# EAGLE design Order339582-10x10-SandyNoble-Polarshieldv1.5 (EAGLE 6.4)
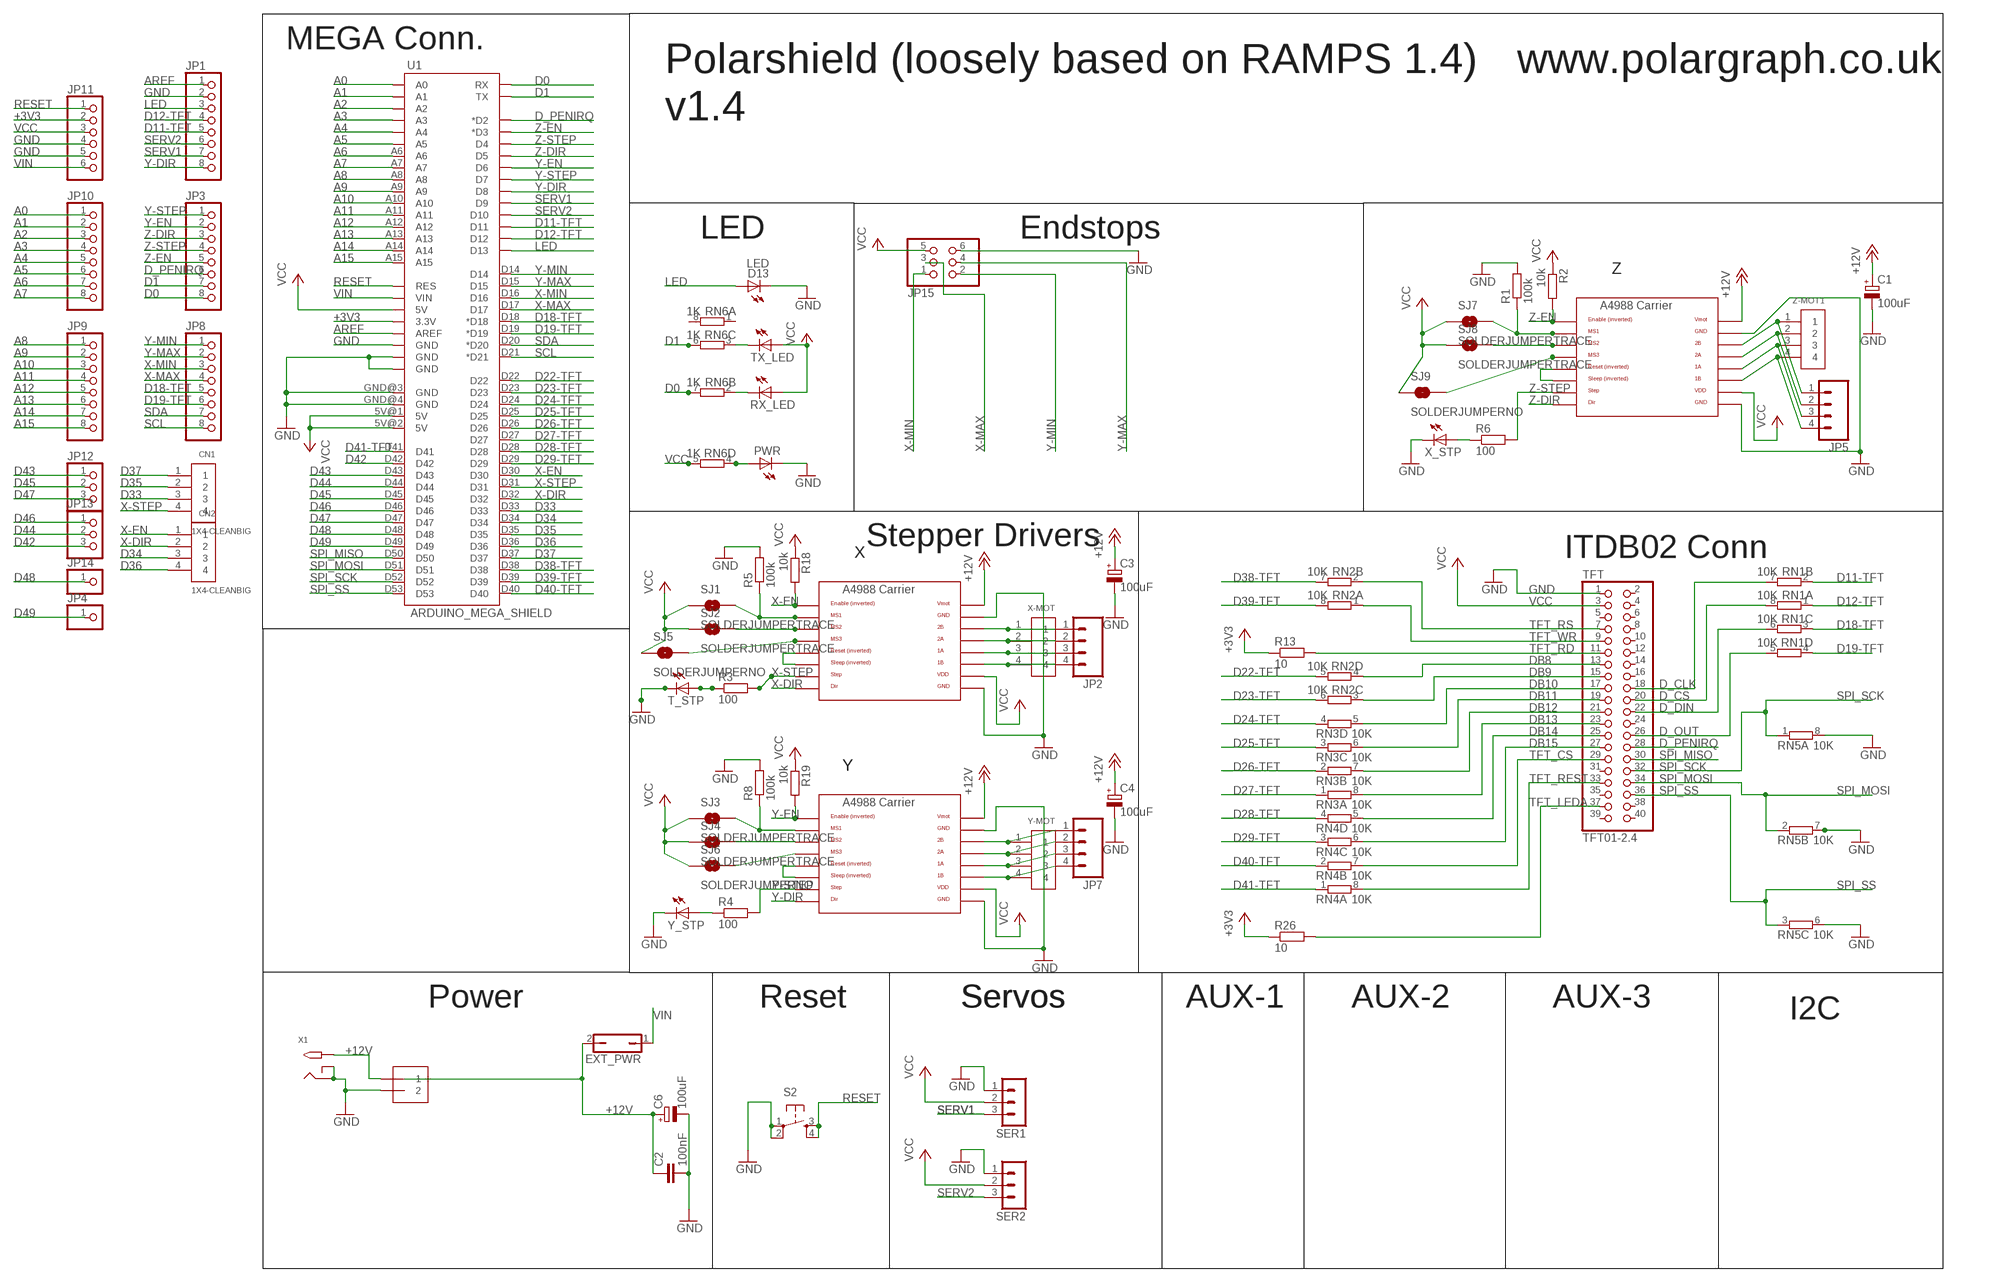
[diagram p0: schematic, sheet 1]

## Parts
C1  100uF  CPOL-EU153CLV-0605  [153CLV-0605]
C2  100nF  C-EUC0805  [C0805]
C3  100uF  CPOL-EU153CLV-0605  [153CLV-0605]
C4  100uF  CPOL-EU153CLV-0605  [153CLV-0605]
C6  100uF  CPOL-EU153CLV-0605  [153CLV-0605]
CN1  1X4-CLEANBIG  [1X04-CLEANBIG]
CN2  1X4-CLEANBIG  [1X04-CLEANBIG]
D13  LED  LEDCHIP-LED0805  [CHIP-LED0805]
EXT_PWR  JP1Q  [JP1]
J1  1X2-3.5MM  [1X2-3.5MM]
JP1  PINHD-1X8CLEANBIG  [1X08-CLEANBIG]
JP2  M04SCREW  [SCREWTERMINAL-3.5MM-4]
JP3  PINHD-1X8CLEANBIG  [1X08-CLEANBIG]
JP4  PINHD-1X1CB  [1X01-CLEANBIG]
JP5  M04SCREW  [SCREWTERMINAL-3.5MM-4]
JP7  M04SCREW  [SCREWTERMINAL-3.5MM-4]
JP8  PINHD-1X8CLEANBIG  [1X08-CLEANBIG]
JP9  PINHD-1X8CLEANBIG  [1X08-CLEANBIG]
JP10  PINHD-1X8CLEANBIG  [1X08-CLEANBIG]
JP11  PINHD-1X6CB  [1X06-CLEANBIG]
JP12  PINHD-1X3CB  [1X03-CLEANBIG]
JP13  PINHD-1X3CB  [1X03-CLEANBIG]
JP14  PINHD-1X1CB  [1X01-CLEANBIG]
JP15  PINHD-2X3  [2X03]
PWR  LEDCHIP-LED0805  [CHIP-LED0805]
R1  100k  R-EU_R0805  [R0805]
R2  10k  R-EU_R0805  [R0805]
R3  100  R-EU_R0805  [R0805]
R4  100  R-EU_R0805  [R0805]
R5  100k  R-EU_R0805  [R0805]
R6  100  R-EU_R0805  [R0805]
R8  100k  R-EU_R0805  [R0805]
R13  10  R-EU_R0805  [R0805]
R18  10k  R-EU_R0805  [R0805]
R19  10k  R-EU_R0805  [R0805]
R26  10  R-EU_R0805  [R0805]
RN1  10K  4R-NEXBS8V  [EXBS8V]
RN2  10K  4R-NEXBS8V  [EXBS8V]
RN3  10K  4R-NEXBS8V  [EXBS8V]
RN4  10K  4R-NEXBS8V  [EXBS8V]
RN5  10K  4R-NEXBS8V  [EXBS8V]
RN6  1K  4R-NEXBS8V  [EXBS8V]
RX_LED  LEDCHIP-LED0805  [CHIP-LED0805]
S2  TAC_SWITCHPTH  [TACTILE-PTH]
SER1  3PIN-HEADER  [3PIN-HEADER]
SER2  3PIN-HEADER  [3PIN-HEADER]
SJ1  SOLDERJUMPERTRACE  [SJ_2S-TRACE]
SJ2  SOLDERJUMPERTRACE  [SJ_2S-TRACE]
SJ3  SOLDERJUMPERTRACE  [SJ_2S-TRACE]
SJ4  SOLDERJUMPERTRACE  [SJ_2S-TRACE]
SJ5  SOLDERJUMPERNO  [SJ_2S-NO]
SJ6  SOLDERJUMPERNO  [SJ_2S-NO]
SJ7  SOLDERJUMPERTRACE  [SJ_2S-TRACE]
SJ8  SOLDERJUMPERTRACE  [SJ_2S-TRACE]
SJ9  SOLDERJUMPERNO  [SJ_2S-NO]
T_STP  LEDCHIP-LED0805  [CHIP-LED0805]
TFT  TFT01-2.4  [TFT01-2.4]
TX_LED  LEDCHIP-LED0805  [CHIP-LED0805]
U1  ARDUINO_MEGA_SHIELD  [ARDUINO_MEGA_SHIELD]
U$1  A4988BREAKOUT  [A4988BREAKOUT]
U$6  A4988BREAKOUT  [A4988BREAKOUT]
U$7  A4988BREAKOUT  [A4988BREAKOUT]
X1  2.1MMJACKTHM  [PJ-102A]
X-MOT  1X4-BIG  [1X04-BIG]
X_STP  LEDCHIP-LED0805  [CHIP-LED0805]
Y-MOT  1X4-BIG  [1X04-BIG]
Y_STP  LEDCHIP-LED0805  [CHIP-LED0805]
Z-MOT1  1X4-BIG  [1X04-BIG]

## Nets
+3V3: JP11.2 R13.1 R26.1 U1.3.3V
+12V [vmot]: C1.+ C2.1 C3.+ C4.+ C6.+ EXT_PWR.2 J1.1 U$1.VMOT U$6.VMOT U$7.VMOT X1.TIP
A0: JP10.1 U1.A0
A1: JP10.2 U1.A1
A2: JP10.3 U1.A2
A3: JP10.4 U1.A3
A4: JP10.5 U1.A4
A5: JP10.6 U1.A5
A6: JP10.7 U1.A6
A7: JP10.8 U1.A7
A8: JP9.1 U1.A8
A9: JP9.2 U1.A9
A10: JP9.3 U1.A10
A11: JP9.4 U1.A11
A12: JP9.5 U1.A12
A13: JP9.6 U1.A13
A14: JP9.7 U1.A14
A15: JP9.8 U1.A15
AREF: JP1.1 U1.AREF
D0: JP3.8 RN6.7 U1.RX
D1: JP3.7 RN6.6 U1.TX
D11-TFT: JP1.5 RN1.2 U1.D11
D12-TFT: JP1.4 RN1.1 U1.D12
D18-TFT: JP8.5 RN1.3 U1.D18(*D18)
D19-TFT [signal]: JP8.6 RN1.4 U1.D19(*D19)
D22-TFT: RN2.5 U1.D22
D23-TFT: RN2.6 U1.D23
D24-TFT: RN3.4 U1.D24
D25-TFT: RN3.3 U1.D25
D26-TFT: RN3.2 U1.D26
D27-TFT: RN3.1 U1.D27
D28-TFT: RN4.4 U1.D28
D29-TFT: RN4.3 U1.D29
D33: CN1.3 U1.D33
D34: CN2.3 U1.D34
D35: CN1.2 U1.D35
D36: CN2.4 U1.D36
D37: CN1.1 U1.D37
D38-TFT: RN2.7 U1.D38
D39-TFT: RN2.8 U1.D39
D40-TFT: RN4.2 U1.D40
D41-TFT: RN4.1 U1.D41
D42: JP13.3 U1.D42
D43: JP12.1 U1.D43
D44: JP13.2 U1.D44
D45: JP12.2 U1.D45
D46: JP13.1 U1.D46
D47: JP12.3 U1.D47
D48: JP14.1 U1.D48
D49: JP4.1 U1.D49
D_CLK: RN1.7 TFT.18
D_CS: RN1.8 TFT.20
D_DIN: RN1.6 TFT.22
D_OUT: RN1.5 TFT.26
D_PENIRQ: JP3.6 TFT.28 U1.D2(*D2)
DB8: RN2.4 TFT.13
DB9: RN2.3 TFT.15
DB10: RN3.5 TFT.17
DB11: RN3.6 TFT.19
DB12: RN3.7 TFT.21
DB13: RN3.8 TFT.23
DB14: RN4.5 TFT.25
DB15: RN4.6 TFT.27
GND [gnd5]: C1.- C2.2 C3.- C4.- C6.- D13.C J1.2 JP1.2 JP11.4 JP11.5 JP15.6 PWR.C R1.2 R5.2 R8.2 RN5.6 RN5.7 RN5.8 S2.1 S2.2 SER1.1 SER2.1 T_STP.C TFT.1 U1.GND@0(GND) U1.GND@1(GND) U1.GND@2(GND) U1.GND@3(GND) U1.GND@4(GND) U$1.GND U$1.GND@0(GND) U$6.GND U$6.GND@0(GND) U$7.GND U$7.GND@0(GND) X1.RING X1.RING_SW X_STP.C Y_STP.C
LED: D13.A JP1.3 U1.D13
N$1: U$6.RST U$6.SLP(SLEEP)
N$2: PWR.A RN6.4
N$3: R5.1 SJ1.2 U$6.MS1
N$4: JP5.1 U$1.2B Z-MOT1.1
N$5: JP5.2 U$1.2A Z-MOT1.2
N$6 [vmot]: JP5.3 U$1.1A Z-MOT1.3
N$7: JP5.4 U$1.1B Z-MOT1.4
N$8: U$1.RST U$1.SLP(SLEEP)
N$9: R1.1 SJ7.2 U$1.MS1
N$10: SJ2.2 U$6.MS2
N$11: SJ8.2 U$1.MS2
N$12: SJ5.2 U$6.MS3
N$13: U$7.RST U$7.SLP(SLEEP)
N$14: SJ9.2 U$1.MS3
N$15: RN6.2 RX_LED.C
N$16: RN6.3 TX_LED.C
N$17: SJ4.2 U$7.MS2
N$18: R4.1 Y_STP.A
N$19: R6.1 X_STP.A
N$21: JP2.1 U$6.2B X-MOT.1
N$22: JP2.2 U$6.2A X-MOT.2
N$23: R3.1 T_STP.A
N$26: JP2.3 U$6.1A X-MOT.3
N$27: JP2.4 U$6.1B X-MOT.4
N$28: JP7.1 U$7.2B Y-MOT.1
N$29: JP7.2 U$7.2A Y-MOT.2
N$30: JP7.3 U$7.1A Y-MOT.3
N$31: SJ6.2 U$7.MS3
N$33: R8.1 SJ3.2 U$7.MS1
N$36: JP7.4 U$7.1B Y-MOT.4
RESET: JP11.1 S2.3 S2.4 U1.RES
SCL: JP8.8 U1.D21(*D21)
SDA: JP8.7 U1.D20(*D20)
SERV1: JP1.7 SER1.3 U1.D9
SERV2: JP1.6 SER2.3 U1.D10
SPI_MISO: TFT.30 U1.D50
SPI_MOSI: RN5.2 TFT.34 U1.D51
SPI_SCK: RN5.1 TFT.32 U1.D52
SPI_SS: RN5.3 TFT.36 U1.D53
TFT_CS: RN4.7 TFT.29
TFT_LEDA: R26.2 TFT.37
TFT_RD: R13.2 TFT.11
TFT_REST: RN4.8 TFT.33
TFT_RS: RN2.2 TFT.7
TFT_WR: RN2.1 TFT.9
VCC: JP11.3 JP15.5 R2.1 R18.1 R19.1 RN6.5 RX_LED.A SER1.2 SER2.2 SJ1.1 SJ2.1 SJ3.1 SJ4.1 SJ5.1 SJ6.1 SJ7.1 SJ8.1 SJ9.1 TFT.3 TX_LED.A U1.5V@0(5V) U1.5V@1(5V) U1.5V@2(5V) U$1.VDD U$6.VDD U$7.VDD
VIN [vcc]: EXT_PWR.1 JP11.6 U1.VIN
X-DIR: CN2.2 U1.D32 U$6.DIR
X-EN: CN2.1 R18.2 U1.D30 U$6.EN
X-MAX: JP8.4 JP15.3 U1.D17
X-MIN: JP8.3 JP15.1 U1.D16
X-STEP: CN1.4 R3.2 U1.D31 U$6.STEP
Y-DIR: JP1.8 U1.D8 U$7.DIR
Y-EN: JP3.2 R19.2 U1.D6 U$7.EN
Y-MAX: JP8.2 JP15.4 U1.D15
Y-MIN: JP8.1 JP15.2 U1.D14
Y-STEP: JP3.1 R4.2 U1.D7 U$7.STEP
Z-DIR: JP3.3 U1.D5 U$1.DIR
Z-EN: JP3.5 R2.2 U1.D3(*D3) U$1.EN
Z-STEP: JP3.4 R6.2 U1.D4 U$1.STEP
Unconnected: RN5.4 RN5.5 RN6.1 RN6.8 TFT.2 TFT.4 TFT.5 TFT.6 TFT.8 TFT.10 TFT.12 TFT.14 TFT.16 TFT.24 TFT.31 TFT.35 TFT.38 TFT.39 TFT.40

## Notes on the sheet
- MEGA Conn.
- Polarshield (loosely based on RAMPS 1.4) | www.polargraph.co.uk
- v1.4
- LED | Endstops
- Z
- Stepper Drivers
- X | ITDB02 Conn
- Y
- Power | Reset | Servos | Servos | AUX-1 | AUX-2 | AUX-3
- I2C

## Library data of the parts
C1 C3 C4 C6 = rcl:CPOL-EU: POLARIZED CAPACITOR, European symbol
C2 = resistor:C-EU: CAPACITOR, European symbol
CN1 CN2 X-MOT Y-MOT Z-MOT1 = adafruit:1X4: 4-pin connector
D13 PWR RX_LED T_STP TX_LED X_STP Y_STP = led:LED: LED OSRAM: - CHIPLED LG R971, LG N971, LY N971, LG Q971, LY Q971, LO R971, LY R971 LH N974, LH R974 LS Q976, LO Q976, LY Q976 LO Q996 - Hyper CHIPLED LW Q18S LB Q993, LB Q99A, LB R99A - SideLED LS A670, LO A670, LY A670, LG A670, LP A670 LB A673, LV A673, LT A673, LW A673 LH A674 LY A675 LS A676, LA A676, LO A676, LY A676, LW A676 LS A679, LY A679, LG A679 - Hyper Micro SIDELED® LS Y876, LA Y876, LO Y876, LY Y876 LT Y87S - SmartLED LW L88C, LW L88S LB L89C, LB L89S, LG L890 LS L89K, LO L89K, LY L89K LS L896, LA L896, LO L896, LY L896 - TOPLED LS T670, LO T670, LY T670, LG T670, LP T670 LSG T670, LSP T670, LSY T670, LOP T670, LYG T670 LG T671, LOG T671, LSG T671 LB T673, LV T673, LT T673, LW T673 LH T674 LS T676, LA T676, LO T676, LY T676, LB T676, LH T676, LSB T676, LW T676 LB T67C, LV T67C, LT T67C, LS T67K, LO T67K, LY T67K, LW E67C LS E67B, LA E67B, LO E67B, LY E67B, LB E67C, LV E67C, LT E67C LW T67C LS T679, LY T679, LG T679 LS T770, LO T770, LY T770, LG T770, LP T770 LB T773, LV T773, LT T773, LW T773 LH T774 LS E675, LA E675, LY E675, LS T675 LS T776, LA T776, LO T776, LY T776, LB T776 LHGB T686 LT T68C, LB T68C - Hyper Mini TOPLED® LB M676 - Mini TOPLED Santana® LG M470 LS M47K, LO M47K, LY M47K Source: http://www.osram.convergy.de LUXEON: - LUMILED® LXK2-PW12-R00, LXK2-PW12-S00, LXK2-PW14-U00, LXK2-PW14-V00 LXK2-PM12-R00, LXK2-PM12-S00, LXK2-PM14-U00 LXK2-PE12-Q00, LXK2-PE12-R00, LXK2-PE12-S00, LXK2-PE14-T00, LXK2-PE14-U00 LXK2-PB12-K00, LXK2-PB12-L00, LXK2-PB12-M00, LXK2-PB14-N00, LXK2-PB14-P00, LXK2-PB14-Q00 LXK2-PR12-L00, LXK2-PR12-M00, LXK2-PR14-Q00, LXK2-PR14-R00 LXK2-PD12-Q00, LXK2-PD12-R00, LXK2-PD12-S00 LXK2-PH12-R00, LXK2-PH12-S00 LXK2-PL12-P00, LXK2-PL12-Q00, LXK2-PL12-R00 Source: www.luxeon.com KINGBRIGHT: KA-3528ASYC Source: www.kingbright.com
EXT_PWR = jumper:JP1Q: JUMPER
J1 = adafruit:1X2: 3.5mm Terminal block http://www.ladyada.net/library/pcb/eaglelibrary.html
JP1 JP3 JP8-JP10 = adafruit:PINHD-1X8: PIN HEADER
JP2 JP5 JP7 = SparkFun:M04: Header 4 Standard 4-pin 0.1" header. Use with straight break away headers (SKU : PRT-00116), right angle break away headers (PRT-00553), swiss pins (PRT-00743), machine pins (PRT-00117), and female headers (PRT-00115). Molex polarized connector foot print use with SKU : PRT-08231 with associated crimp pins and housings. 1MM SMD Version SKU: PRT-10208
JP4 JP14 = adafruit:PINHD-1X1: Pin header 1x1 for 0.1" spacing With round pins
JP11 = adafruit:PINHD-1X6: PIN HEADER
JP12 JP13 = adafruit:PINHD-1X3: PIN HEADER
JP15 = pinhead:PINHD-2X3: PIN HEADER
R1-R6 R8 R18 R19 = rcl:R-EU_: RESISTOR, European symbol
R13 R26 = resistor:R-EU_: RESISTOR, European symbol
RN1-RN6 = resistor-dil:4R-N: Array Chip Resistor Source: RS Component / Phycomp; OC_FARNELL: unknown; OC_NEWARK: unknown
S2 = SparkFun:TAC_SWITCH: Momentary Switch Button commonly used for reset or general input. Spark Fun Electronics SKU : COM-00097
SER1 SER2 = ultimachine:3PIN-HEADER: PIN HEADER
SJ1-SJ9 = SparkFun:SOLDERJUMPER: Solder Jumper Standard SMD solder jumper. Used to automate production. Two varients : Normally Open and Normally Closed are the same, but have different paste layers. NC will have a large amount of paste and should jumper during reflow.
TFT = sandy:TFT01-2.4
U1 = RepRapjr:ARDUINO_MEGA_SHIELD
U$1 U$6 U$7 = RepRapjr:A4988BREAKOUT
X1 = adafruit:2.1MMJACK: 2.1mm x 5.5mm THM DC jack with internal switch. Digikey part #PJ-102A, 4UCON part #05537 2.1mm x 5.5mm SMT DC jack with internal switch. Digikey part #PJ-002A-SMT, 4UCON part #03267 By microbuilder.eu & adafruit.com

## Net classes
0 default: width 0.406 mm
1 gnd12: width 1.422 mm
2 gnd5: width 1.422 mm
3 vmot: width 1.422 mm
4 vcc: width 0.406 mm
5 signal: width 0.406 mm

## Board
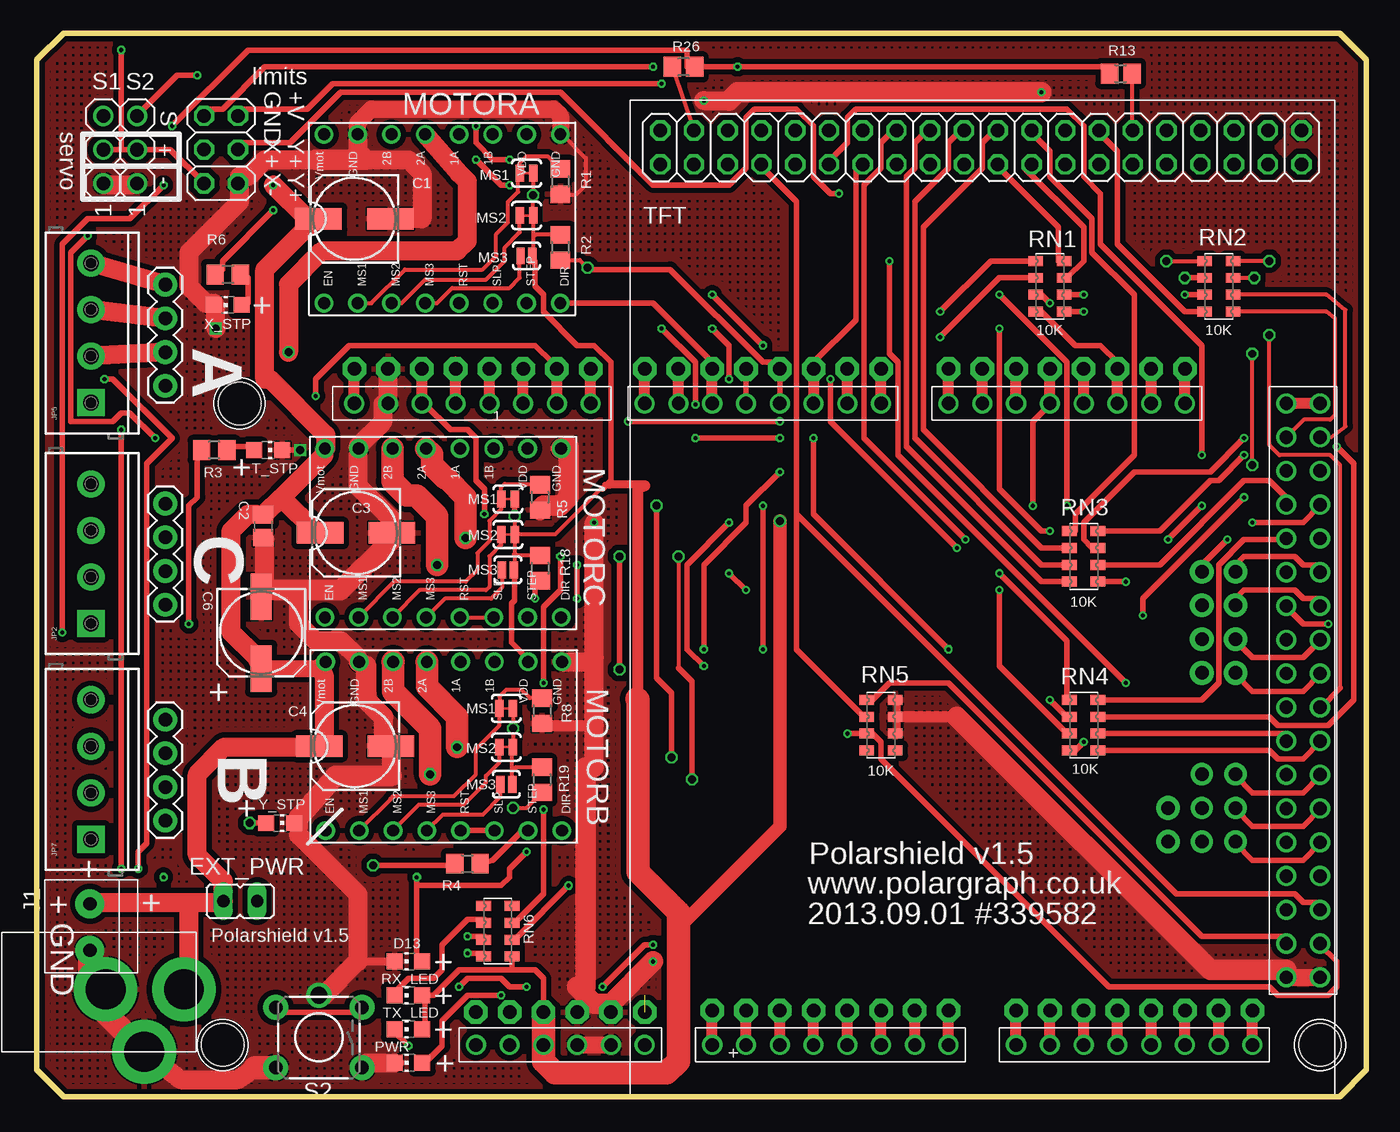
[diagram p1: board, top side]
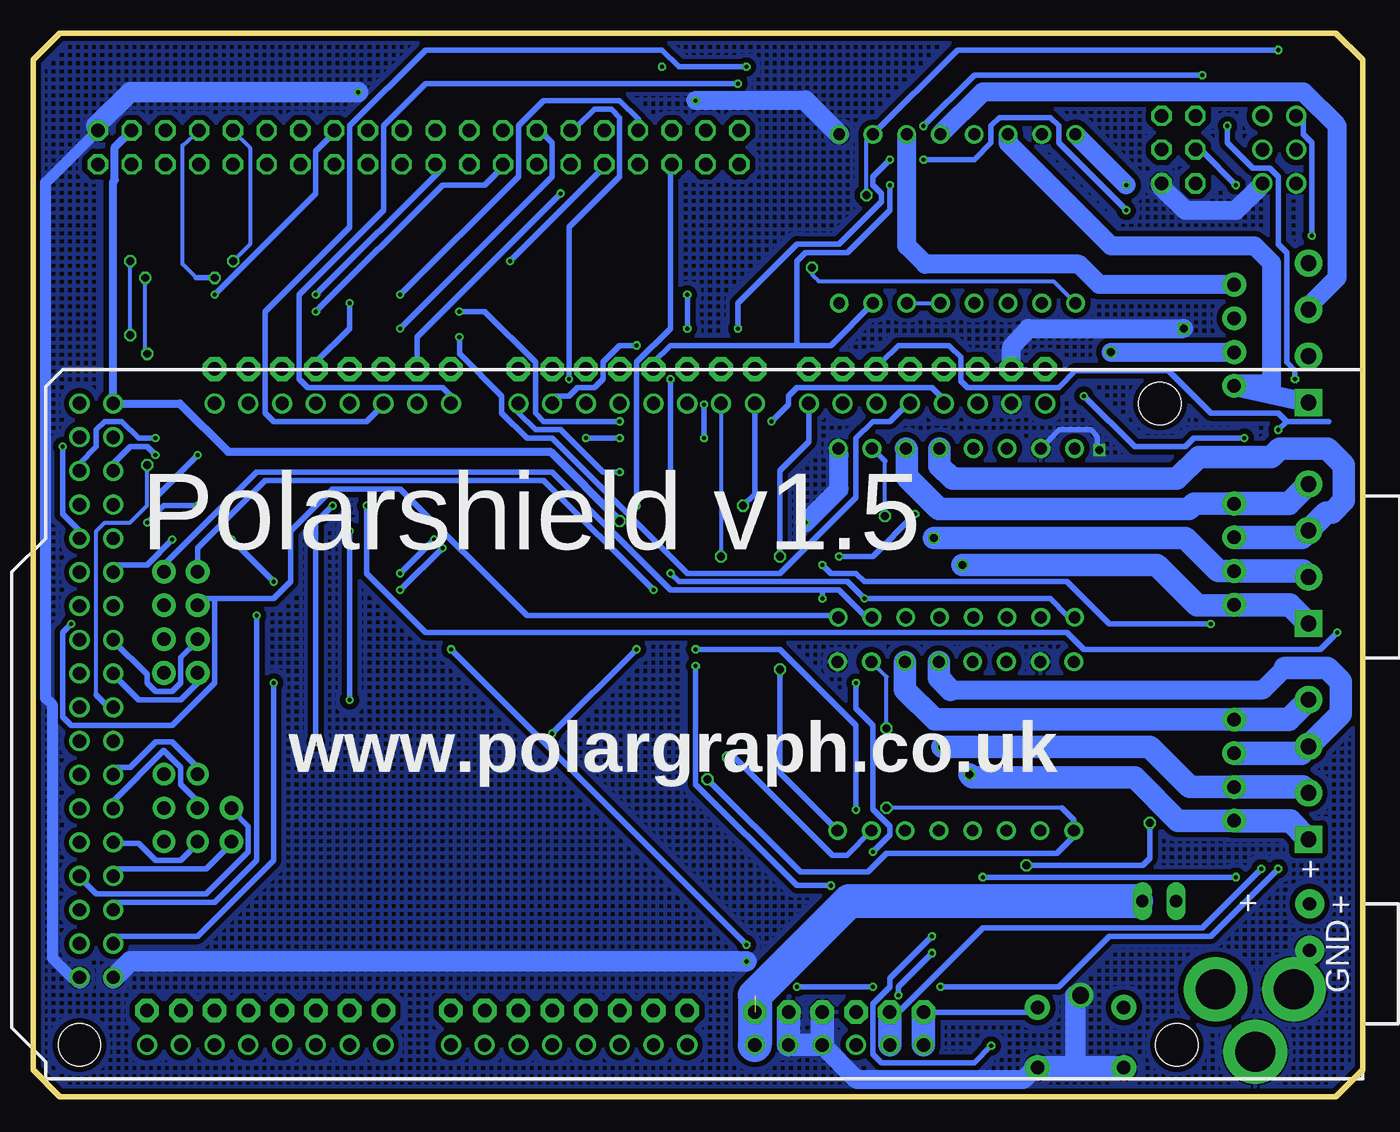
[diagram p2: board, bottom side, seen from below]

Size 100 x 80 mm. Coordinates in mm from the lower left corner, seen from the top.
Outline: 100,2 100,78 98,80 2,80 0,78 0,2 2,0 98,0 100,2
Copper layers (1*16): Top 0.035mm / dielectric 1.5mm / Bottom 0.035mm
Design rules "ElecFreaks_CAM_DRC_V1.0 *": minimum track width 6mil, minimum drill 12mil, track to track 6mil, track to pad 6mil, pad to pad 6mil, via to via 6mil, smd to smd 0mil, copper to edge 10mil, drill to drill 10mil, minimum pad ring 10mil, minimum via ring 6mil, stop-mask expansion 2mil, vias tented up to drill 100mil, thermal gap 5mil

### Footprints (pad centres in the part's own frame; a part is rotated, then mirrored left to right if it is on the bottom)
153CLV-0605 = smd 3.5 x 1.6: + 2.7,0; - -2.7,0
C0805 = smd 1.3 x 1.5: 1 -0.85,0; 2 0.85,0
1X04-CLEANBIG = drill 1.016 pad 1.778: 1 -3.81,0; 2 -1.27,0; 3 1.27,0; 4 3.81,0
CHIP-LED0805 = smd 1.2 x 1.2: A 0,-1.05; C 0,1.05
JP1 = drill 0.914 long: 1 0,-1.27; 2 0,1.27
1X2-3.5MM = drill 1 pad 2.184: 1 1.8,0; 2 -1.7,0
1X08-CLEANBIG = drill 1.016 pad 1.778 octagon: 1 -8.89,0; 2 -6.35,0; 3 -3.81,0; 4 -1.27,0; 5 1.27,0; 6 3.81,0; 7 6.35,0; 8 8.89,0
SCREWTERMINAL-3.5MM-4 = drill 1.2 pad 2.032 square: 1 0,0 | drill 1.2 pad 2.032: 2 3.5,0; 3 7,0; 4 10.5,0
1X01-CLEANBIG = drill 1.016 pad 1.778: 1 0,0
1X06-CLEANBIG = drill 1.016 pad 1.778 octagon: 1 -6.35,0; 2 -3.81,0; 3 -1.27,0; 4 1.27,0; 5 3.81,0; 6 6.35,0
1X03-CLEANBIG = drill 1.016 pad 1.676: 1 -2.54,0; 2 0,0; 3 2.54,0
2X03 = drill 1.016 octagon: 1 -2.54,-1.27; 2 -2.54,1.27; 3 0,-1.27; 4 0,1.27; 5 2.54,-1.27; 6 2.54,1.27
R0805 = smd 1.3 x 1.5: 1 -0.95,0; 2 0.95,0
R0805' = smd 1.3 x 1.5: 1 -0.85,0; 2 0.85,0
EXBS8V = smd 0.75 x 1.1: 1 -1.905,-1.07; 2 -0.635,-1.07; 3 0.635,-1.07; 4 1.905,-1.07; 5 1.905,1.07; 6 0.635,1.07; 7 -0.635,1.07; 8 -1.905,1.07
TACTILE-PTH = drill 1.016 pad 1.88: 1 -3.251,2.261; 2 3.251,2.261; 3 -3.251,-2.261; 4 3.251,-2.261
3PIN-HEADER = drill 1.016: 1 -2.54,0; 2 0,0; 3 2.54,0
SJ_2S-TRACE = smd 0.635 x 1.27: 1 -0.508,0; 2 0.508,0
SJ_2S-NO = smd 0.635 x 1.27: 1 -0.45,0; 2 0.45,0
TFT01-2.4 = drill 1.016 octagon: 1 0.98,24.02; 2 3.52,24.02; 3 0.98,21.48; 4 3.52,21.48; 5 0.98,18.94; 6 3.52,18.94; 7 0.98,16.4; 8 3.52,16.4; 9 0.98,13.86; 10 3.52,13.86; 11 0.98,11.32; 12 3.52,11.32; 13 0.98,8.78; 14 3.52,8.78; 15 0.98,6.24; 16 3.52,6.24; 17 0.98,3.7; 18 3.52,3.7; 19 0.98,1.16; 20 3.52,1.16; 21 0.98,-1.38; 22 3.52,-1.38; 23 0.98,-3.92; 24 3.52,-3.92; 25 0.98,-6.46; 26 3.52,-6.46; 27 0.98,-9; 28 3.52,-9; 29 0.98,-11.54; 30 3.52,-11.54; 31 0.98,-14.08; 32 3.52,-14.08; 33 0.98,-16.62; 34 3.52,-16.62; 35 0.98,-19.16; 36 3.52,-19.16; 37 0.98,-21.7; 38 3.52,-21.7; 39 0.98,-24.24; 40 3.52,-24.24
ARDUINO_MEGA_SHIELD = drill 1 pad 1.422: 3.3V 35.56,2.54; 5V@0 38.1,2.54; 5V@1 93.98,50.8; 5V@2 96.52,50.8; A0 50.8,2.54; A1 53.34,2.54; A2 55.88,2.54; A3 58.42,2.54; A4 60.96,2.54; A5 63.5,2.54; A6 66.04,2.54; A7 68.58,2.54; A8 73.66,2.54; A9 76.2,2.54; A10 78.74,2.54; A11 81.28,2.54; A12 83.82,2.54; A13 86.36,2.54; A14 88.9,2.54; A15 91.44,2.54; AREF 23.876,50.8; D2 58.42,50.8; D3 55.88,50.8; D4 53.34,50.8; D5 50.8,50.8; D6 48.26,50.8; D7 45.72,50.8; D8 41.656,50.8; D9 39.116,50.8; D10 36.576,50.8; D11 34.036,50.8; D12 31.496,50.8; D13 28.956,50.8; D14 68.58,50.8; D15 71.12,50.8; D16 73.66,50.8; D17 76.2,50.8; D18 78.74,50.8; D19 81.28,50.8; D20 83.82,50.8; D21 86.36,50.8; D22 93.98,48.26; D23 96.52,48.26; D24 93.98,45.72; D25 96.52,45.72; D26 93.98,43.18; D27 96.52,43.18; D28 93.98,40.64; D29 96.52,40.64; D30 93.98,38.1; D31 96.52,38.1; D32 93.98,35.56; D33 96.52,35.56; D34 93.98,33.02; D35 96.52,33.02; D36 93.98,30.48; D37 96.52,30.48; D38 93.98,27.94; D39 96.52,27.94; D40 93.98,25.4; D41 96.52,25.4; D42 93.98,22.86; D43 96.52,22.86; D44 93.98,20.32; D45 96.52,20.32; D46 93.98,17.78; D47 96.52,17.78; D48 93.98,15.24; D49 96.52,15.24; D50 93.98,12.7; D51 96.52,12.7; D52 93.98,10.16; D53 96.52,10.16; GND@0 40.64,2.54; GND@1 43.18,2.54; GND@2 26.416,50.8; GND@3 93.98,7.62; GND@4 96.52,7.62; RES 33.02,2.54; RX 63.5,50.8; TX 60.96,50.8; VIN 45.72,2.54 | hole 3.2: 96.52,2.54; 13.97,2.54; 15.24,50.8
A4988BREAKOUT = drill 0.9: 1A 8.89,1.27; 1B 11.43,1.27; 2A 6.35,1.27; 2B 3.81,1.27; DIR 16.51,-11.43; EN -1.27,-11.43; GND 16.51,1.27; GND@0 1.27,1.27; MS1 1.27,-11.43; MS2 3.81,-11.43; MS3 6.35,-11.43; RST 8.89,-11.43; SLP 11.43,-11.43; STEP 13.97,-11.43; VDD 13.97,1.27; VMOT -1.27,1.27
PJ-102A = drill 3 pad 4.8: RING 0.1,-3.39; RING_SW -4.6,-6.29; TIP 0.1,-9.29
1X04-BIG = drill 1.016 pad 1.778: 1 0,0; 2 2.54,0; 3 5.08,0; 4 7.62,0

### Placement (x,y rotation side)
C1  23.88,66.04 180 top
C2  17.03,42.91 270 top
C3  24,42.41 180 top
C4  23.93,26.37 180 top
C6  16.87,34.89 270 top
CN1  90.17,35.69 90 top
CN2  87.63,35.69 270 bottom
D13  27.94,10.16 90 top
EXT_PWR  15.29,14.71 90 top
J1  3.99,12.7 90 top
JP1  32.77,54.74 0 top
JP2  4.06,35.6 90 top
JP3  54.61,54.74 0 top
JP4  85.09,21.72 0 top
JP5  4.06,52.2 90 top
JP7  4.06,19.36 90 top
JP8  77.47,54.74 0 top
JP9  82.55,6.48 0 top
JP10  59.69,6.48 0 top
JP11  39.37,6.35 0 top
JP12  90.17,21.72 270 bottom
JP13  87.63,21.72 90 top
JP14  85.09,19.18 0 top
JP15  13.84,71.25 270 top
PWR  27.94,2.54 90 top
R1  39.37,68.83 270 top
R2  39.37,63.88 270 top
R3  13.34,48.64 180 top
R4  32.38,17.53 0 top
R5  37.85,45.09 270 top
R6  14.35,61.85 180 top
R8  38.01,29.02 270 top
R13  10  [R0805']  81.53,76.96 0 top
R18  37.85,39.75 270 top
R19  37.99,23.83 270 top
R26  10  [R0805']  48.64,77.47 180 top
RN1  76.2,60.96 270 top
RN2  88.9,60.96 270 top
RN3  78.74,40.64 90 top
RN4  78.74,27.94 90 top
RN5  63.5,27.94 270 top
RN6  34.67,12.45 270 top
RX_LED  27.94,7.62 90 top
S2  21.21,4.45 180 top
SER1  4.99,71.24 90 top
SER2  7.53,71.24 90 top
SJ1  35.43,44.96 180 top
SJ2  35.43,42.29 180 top
SJ3  35.31,29.21 180 top
SJ4  35.31,26.29 180 top
SJ5  35.43,39.62 180 top
SJ6  35.31,23.5 180 top
SJ7  36.83,69.47 180 top
SJ8  36.83,66.29 180 top
SJ9  36.83,63.25 180 top
T_STP  17.4,48.64 270 top
TFT  71.12,73.66 270 top
TX_LED  27.94,5.08 90 top
U1  0,1.35 0 top
U$1  22.86,71.12 0 top
U$6  22.93,47.49 0 top
U$7  22.98,31.44 0 top
X1  1.77,7.97 90 top
X-MOT  9.65,37 90 top
X_STP  14.35,59.56 90 top
Y-MOT  9.65,20.75 90 top
Y_STP  18.29,20.57 270 top
Z-MOT1  9.65,53.47 90 top

### Tracks (layer width: path | path; a pad name or v marks a point on that pad's centre or on a via)
+3V3  (via drill 0.3)
  Top 0.406: R13.1 80.64,77.47 v52.7,77.47 R26.1 48.9,77.47 48.9,78.74 15.88,78.74 v10.16,73.03 | v7.62,17.14 7.62,18.41 8.26,19.05 8.26,47.62 10.16,49.53 5.71,53.98 v5.08,53.98
  Bottom 0.406: v7.62,17.14 12.06,12.7 28.57,12.7 34.92,6.35 JP11.2 | v5.08,53.98 5.08,54.61 5.71,55.24 5.71,63.5 6.35,64.14 6.35,69.22 6.99,69.85 8.26,69.85 10.16,71.75 v10.16,73.03
  Bottom 1.778: JP11.2 U1.3.3V
+12V  (via drill 0.3)
  Top 0.406: 20.95,26.04 C4.+ | 16.51,32.38 C6.+ | 17.14,43.81 C2.1 16.51,43.81
  Top 1.27: C6.+ 21.19,32.19 U$7.VMOT
  Top 1.422: v17.78,68.58 20.32,66.04 C1.+ 20.32,65.41 17.14,62.23 17.14,53.98 17.53,53.98 21.72,49.78 21.72,48.82 U$6.VMOT 21.59,48.26 18.41,45.09 | 21.19,32.19 21.59,31.75 21.59,26.67 C4.+ 21.15,26.29 14.1,26.29 12.06,24.26 12.06,18.16 14.02,16.2 EXT_PWR.2 13.97,14.61 11.43,14.61 | 11.43,14.61 4.45,14.61 J1.1 | 11.43,14.61 11.43,8.26 X1.TIP | 18.41,45.09 17.14,43.81 | 18.41,45.09 20.95,42.55 C3.+ | 16.51,43.81 15.88,43.81 14.61,42.55 14.61,34.92 16.51,33.02 C6.+
  Bottom 1.422: v17.78,68.58 U$1.VMOT
A0
  Top 0.813: U1.A0 JP10.1
A1
  Top 0.813: U1.A1 JP10.2
A2
  Top 0.813: U1.A2 JP10.3
A3
  Top 0.813: U1.A3 JP10.4
A4
  Top 0.813: U1.A4 JP10.5
A5
  Top 0.813: U1.A5 JP10.6
A6
  Top 0.813: U1.A6 JP10.7
A7
  Top 0.813: U1.A7 JP10.8
A8
  Top 0.813: U1.A8 JP9.1
A9
  Top 0.813: U1.A9 JP9.2
A10
  Top 0.813: U1.A10 JP9.3
A11
  Top 0.813: U1.A11 JP9.4
A12
  Top 0.813: U1.A12 JP9.5
A13
  Top 0.813: U1.A13 JP9.6
A14
  Top 0.813: U1.A14 JP9.7
A15
  Top 0.813: U1.A15 JP9.8
AREF
  Top 0.813: U1.AREF JP1.1
D0  (via drill 0.3)
  Top 0.406: v38.1,21.59 38.1,15.24 36.2,13.34 RN6.7 | v50.16,33.66 50.16,40.01 53.34,43.18 53.34,44.45 v55.88,46.99
  Top 0.813: U1.RX JP3.8
  Bottom 0.406: v38.1,21.59 38.1,27.94 43.81,33.66 v50.16,33.66 | v55.88,46.99 57.15,46.99 60.33,50.16 62.23,50.16 63.5,51.44 U1.RX
D1  (via drill 0.3)
  Top 0.406: v40.01,15.88 36.2,12.06 RN6.6 | v50.16,32.38 48.9,33.66 48.9,40.01 v52.07,43.18 | v52.07,53.98 52.07,56.52 v50.8,57.78 | v54.61,56.52 v50.8,60.33
  Top 0.813: U1.TX JP3.7
  Bottom 0.406: v40.01,15.88 42.55,15.88 50.16,23.5 v50.16,32.38 | v52.07,53.98 v52.07,43.18 | v50.8,60.33 v50.8,57.78 | v54.61,56.52 55.88,56.52 57.15,55.24 57.15,53.98 57.78,53.34 59.05,53.34 59.69,52.7 60.96,52.7 U1.TX
D11-TFT  (via drill 0.3)
  Top 0.406: JP1.5 34.04,55.24 | RN1.2 72.39,61.59 v67.94,57.15
  Top 0.813: U1.D11 JP1.5
  Bottom 0.406: v67.94,57.15 67.94,55.88 64.77,52.7 64.77,51.44 62.87,49.53 60.96,49.53 50.8,39.37 43.81,39.37 38.1,45.09 38.1,49.53 36.83,50.8 35.56,50.8 34.29,52.07 U1.D11
D12-TFT  (via drill 0.3)
  Top 0.406: JP1.4 31.5,55.5 | RN1.1 71.75,62.87 v67.94,59.05 | v44.45,50.8 v55.88,50.8
  Top 0.813: U1.D12 JP1.4
  Bottom 0.406: v67.94,59.05 66.04,59.05 62.23,55.24 62.23,51.44 61.59,50.8 v55.88,50.8 | v44.45,50.8 43.18,52.07 43.18,52.7 42.55,53.34 32.38,53.34 31.75,52.7 U1.D12
D18-TFT  (via drill 0.3)
  Top 0.406: v76.2,59.69 75.56,60.33 RN1.3
  Top 0.813: U1.D18 JP8.5
  Bottom 0.406: v76.2,59.69 76.2,57.78 78.74,55.24 JP8.5
D19-TFT
  Top 0.406: RN1.4 75.56,59.05 78.11,56.52 80.01,56.52 81.28,55.24 JP8.6
  Top 0.813: U1.D19 JP8.6
D22-TFT
  Top 0.305: U1.D22 95.3,50.93 97.28,50.93 97.66,51.31 97.66,58.55 97.03,59.05 RN2.5
D23-TFT
  Top 0.305: U1.D23 97.36,49.61 98.42,50.42 98.42,59.18 97.03,60.33 RN2.6
D24-TFT  (via drill 0.3)
  Top 0.406: RN3.4 84.45,42.55 88.27,46.35 88.9,46.35 v90.81,48.26
  Bottom 0.406: v90.81,48.26 91.44,48.9 92.71,48.9 93.98,47.62 U1.D24
D25-TFT  (via drill 0.3)
  Top 0.406: v90.81,49.53 88.27,46.99 82.55,46.99 78.74,43.18 78.74,41.91 79.38,41.27 RN3.3
  Bottom 0.406: v90.81,49.53 92.08,49.53 93.34,50.8 94.61,50.8 95.25,50.16 95.25,48.9 96.52,47.62 U1.D25
D26-TFT
  Top 0.406: RN3.2 84.45,40.01 90.81,46.35 92.71,46.35 93.98,45.09 U1.D26
D27-TFT  (via drill 0.3)
  Top 0.406: v81.92,38.73 RN3.1 | v87.63,44.45 v85.09,41.91 | v91.44,43.18 95.25,43.18 96.52,44.45 U1.D27
  Bottom 0.406: v85.09,41.91 v81.92,38.73 | v87.63,44.45 90.17,44.45 v91.44,43.18
D28-TFT
  Top 0.406: RN4.4 87.63,29.84 88.9,31.11 88.9,40.01 90.81,41.91 93.98,41.91 U1.D28
D29-TFT  (via drill 0.3)
  Top 0.406: RN4.3 92.71,28.57 93.34,27.94 97.16,27.94 99.06,29.84 99.06,47.62 v97.79,48.9
  Bottom 0.406: v97.79,48.9 97.79,43.81 96.52,42.55 U1.D29
D33
  Top 0.406: U1.D33 96.52,37.47 95.25,37.47 94.61,38.1 90.81,38.1 90.17,37.47 CN1.3
D34
  Bottom 0.406: U1.D34 93.98,34.29 91.44,31.75 91.44,31.11 90.81,30.48 89.53,30.48 88.9,31.11 88.9,33.02 87.63,34.29 CN2.3
D35
  Top 0.406: U1.D35 96.52,34.29 95.25,33.02 91.44,33.02 90.17,34.29 CN1.2
D36
  Bottom 0.406: CN2.4 87.63,31.11 88.9,29.84 92.08,29.84 93.98,31.75 U1.D36
D37
  Top 0.406: U1.D37 96.52,31.75 95.25,30.48 91.44,30.48 90.17,31.75 CN1.1
D38-TFT  (via drill 0.6)
  Top 0.305: RN2.7 v91.57,61.59 | v91.44,47.5 v91.44,55.88
  Bottom 0.305: v91.44,47.5 91.44,44.45 92.71,43.18 94.61,43.18 95.25,42.55 95.25,30.23 | v91.44,55.88 91.57,56.01 v91.57,61.59
  Bottom 0.406: U1.D38 94.31,29.29 95.25,30.23
D39-TFT  (via drill 0.6)
  Top 0.305: 98.04,30.73 98.04,47.5 97.28,48.26 93.47,48.26 92.71,49.02 v92.71,57.28 | v92.71,62.87 RN2.8
  Top 0.406: U1.D39 96.6,29.29 98.04,30.73
  Bottom 0.305: v92.71,57.28 v92.71,62.87
D40-TFT
  Top 0.406: RN4.2 93.98,27.3 U1.D40
D41-TFT
  Top 0.406: RN4.1 92.71,26.04 93.34,25.4 95.25,25.4 96.52,26.67 U1.D41
D42
  Bottom 0.406: U1.D42 93.98,24.77 92.71,24.77 90.81,26.67 89.53,26.67 87.63,24.77 JP13.3
D43
  Top 0.406: U1.D43 96.52,24.13 95.25,22.86 91.44,22.86 90.17,24.13 JP12.1
D44
  Bottom 0.406: U1.D44 93.98,22.23 90.17,26.04 88.9,24.77 88.9,23.5 87.63,22.23 JP13.2
D45
  Top 0.406: U1.D45 96.52,21.59 95.25,20.32 91.44,20.32 90.17,21.59 JP12.2
D46
  Bottom 0.406: U1.D46 93.98,19.05 92.08,19.05 90.81,17.78 88.9,17.78 87.63,19.05 JP13.1
D47
  Top 0.406: U1.D47 96.52,19.05 95.25,17.78 91.44,17.78 90.17,19.05 JP12.3
D48
  Bottom 0.406: U1.D48 93.98,17.14 87,17.14 85.09,19.05 JP14.1
D49
  Bottom 0.406: U1.D49 96.52,16.51 95.25,15.24 87,15.24 83.82,18.41 83.82,20.32 85.09,21.59 JP4.1
D_CLK
  Top 0.406: RN1.7 77.47,61.59 78.74,62.87 78.74,65.41 74.3,69.85 TFT.18
D_CS
  Top 0.406: RN1.8 76.83,62.87 76.83,65.41 72.39,69.85 TFT.20
D_DIN  (via drill 0.3)
  Top 0.406: v78.74,60.33 RN1.6
  Bottom 0.406: v78.74,60.33 69.22,69.85 TFT.22
D_OUT  (via drill 0.3)
  Top 0.406: v78.74,59.05 RN1.5
  Bottom 0.406: v78.74,59.05 69.22,68.58 66.04,68.58 64.77,69.85 TFT.26
D_PENIRQ
  Top 0.406: TFT.28 61.59,69.85 61.59,58.42 58.42,55.24 JP3.6
  Top 0.813: JP3.6 U1.D2
DB8
  Top 0.406: RN2.4 86.36,59.05 81.28,64.14 81.28,71.12 80.01,72.39 TFT.13
DB9  (via drill 0.3)
  Top 0.406: TFT.15 77.36,72.63 | v86.36,60.33 RN2.3
  Bottom 0.406: v86.36,60.33 78.74,67.94 78.74,71.12 77.47,72.39 TFT.15
DB10
  Top 0.406: RN3.5 78.11,42.55 78.11,43.81 82.55,48.26 82.55,60.33 79.38,63.5 79.38,66.04 76.2,69.22 76.2,71.12 74.93,72.39 TFT.17
DB11
  Top 0.406: RN3.6 75.56,41.27 66.67,50.16 66.67,65.41 71.12,69.85 71.12,71.75 71.75,72.39 TFT.19
DB12
  Top 0.406: RN3.7 75.56,40.01 66.04,49.53 66.04,67.31 68.58,69.85 68.58,71.75 69.22,72.39 TFT.21
DB13
  Top 0.406: RN3.8 75.56,38.73 65.41,48.9 65.41,69.22 66.04,69.85 66.04,71.75 66.67,72.39 TFT.23
DB14  (via drill 0.3)
  Top 0.406: v72.39,39.37 77.47,34.29 77.47,29.84 RN4.5 | v69.85,41.91 62.23,49.53 62.23,68.58 63.5,69.85 63.5,71.75 64.14,72.39 TFT.25
  Bottom 0.406: v69.85,41.91 v72.39,39.37
DB15  (via drill 0.3)
  Top 0.406: v76.2,29.84 77.47,28.57 RN4.6 | v76.2,42.55 75.56,42.55 72.39,45.72 v72.39,57.78
  Bottom 0.406: v76.2,42.55 v76.2,29.84 | v72.39,57.78 60.96,69.22 60.96,71.75 61.59,72.39 TFT.27
GND  (via drill 0.3, 0.6, 1.27)
  Top 0.305: U$1.GND 39.5,72.39 41.27,70.61 41.27,68.58 40.51,67.82 39.44,67.82 R1.2
  Top 0.406: 64.77,28.57 64.77,29.84 RN5.8 | 64.77,28.57 RN5.7 | 16.51,38.1 C6.- | RN5.6 64.77,27.3 64.77,28.57 | 19.68,19.68 19.68,20.32 19.43,20.57 Y_STP.C | v19.81,48.64 T_STP.C | 17.14,41.91 C2.2
  Top 0.61: 38.1,27.94 R8.2 | 24.13,10.16 D13.C
  Top 0.813: 69.22,28.57 64.77,28.57 | 38.1,27.94 41.91,27.94
  Top 1.27: U1.GND@0 U1.GND@1 | U1.GND@3 U1.GND@4 | U$1.GND@0 24.13,73.28 25.15,74.3 38.86,74.3 39.37,73.79 U$1.GND
  Top 1.422: 16.41,2.18 15.11,1.27 10.79,1.27 X1.RING_SW | U$1.GND@0 24.13,71.12 24.77,70.48 27.94,70.48 28.96,69.47 28.96,66.04 C1.- | 26.04,28.57 26.04,26.67 | 26.67,24.13 26.67,26.67 | 24.13,48.9 26.04,50.8 26.04,52.07 U1.GND@2 | SER1.1 5.08,68.58 6.99,68.58 SER2.1 | 20.95,70.48 17.14,70.48 15.88,69.22 15.24,69.22 JP15.6 15.24,68.58 15.24,67.31 11.43,63.5 11.43,60.96 12.7,59.69 13.34,59.69 X_STP.C 13.46,59.4 v13.46,57.78 | 41.91,33.02 41.91,27.94 41.91,24.77 41.27,24.77 | 41.91,33.02 v41.91,43.18 | 19.68,38.1 19.68,35.56 20.95,34.29 22.86,34.29 24.13,33.02 U$7.GND@0 | PWR.C 24.77,2.54 S2.1 | v21.21,7.62 21.59,7.62 24.13,10.16 24.13,15.24 19.68,19.68 | JP11.5 43.18,6.99 | 19.68,20.32 19.68,20.95 | 17.14,41.91 17.14,38.73 C6.- | v50.16,74.93 52.07,74.93 | 26.42,52.2 JP1.2 | U$7.GND 41.6,32.71 41.91,33.02 | 24.13,48.26 24.13,45.97 26.67,43.43 26.67,42.44 C3.-
  Top 1.524: 24.77,70.48 20.95,70.48 | 69.22,28.57 88.27,9.53 93.98,9.53 U1.GND@3 | v46.35,10.16 43.18,6.99 41.91,6.99 40.64,8.26 41.27,8.26 41.27,24.77 | 26.04,28.57 24.77,29.84 24.77,32.38 U$7.GND@0 | 26.04,26.67 C4.- | C6.- 17.14,38.1 19.68,38.1 22.86,38.1 26.67,41.91 C3.- | v75.56,75.56 52.7,75.56 52.07,74.93 | R5.2 38.1,44.45 39.37,44.45 40.01,45.09 40.01,48.9 U$6.GND | 19.68,20.95 22.48,24.13 26.67,24.13
  Top 1.778: J1.2 3.99,9.24 X1.RING 5.16,6.27 X1.RING_SW | 16.41,2.18 S2.2
  Bottom 0.406: v19.81,48.64 19.94,48.77 19.94,49.66 20.45,50.16 22.8,50.16 U$6.GND@0
  Bottom 0.813: 96.52,8.89 97.03,8.89 98.55,10.41 98.55,29.46 99.06,29.97 99.06,68.76 TFT.1
  Bottom 1.422: 24.61,2.18 25.53,1.27 38.02,1.27 U1.GND@0 | SER2.1 7.62,68.58 9.53,66.67 13.34,66.67 15.24,68.58 JP15.6 | v41.91,43.18 39.37,45.72 39.37,48.26 U$6.GND | 41.91,74.93 v50.16,74.93 | JP1.2 26.42,56.39 25.15,57.78 v13.46,57.78
  Bottom 1.524: v46.35,10.16 92.71,10.16 93.98,8.89 U1.GND@3 | 96.52,8.89 U1.GND@4 | 21.59,2.18 21.59,7.62 v21.21,7.62 | v75.56,75.56 92.71,75.56 95.25,73.03 TFT.1 | U$1.GND 41.91,74.93
  Bottom 1.676: U1.GND@0 U1.GND@1
  Bottom 1.778: S2.2 21.59,2.18 S2.1 24.61,2.18 | U1.GND@1 JP11.5 | U1.GND@0 JP11.4
  pour Top (isolate 0.406, hatched): 0,81.28 101.6,81.28 101.6,0 0,0
  pour Bottom (isolate 0.406, hatched): -2.54,81.28 -7.62,81.28 -7.62,0 104.14,0 104.14,81.28
LED  (via drill 0.3)
  Top 0.406: v28.57,16.51 28.57,15.88 | 28.57,15.88 28.57,10.16 D13.A | v33.66,43.81 33.66,45.72 33.02,46.35 33.02,49.53 32.38,50.16 31.11,50.16 29.21,52.07 U1.D13 | v39.37,40.64 39.37,38.1 38.1,36.83 v38.1,31.11 | v36.83,18.41 35.56,17.14 35.56,16.51 34.92,15.88 28.57,15.88
  Top 0.813: U1.D13 JP1.3
  Bottom 0.406: v9.53,16.51 v28.57,16.51 | 28.57,52.07 U1.D13 | v33.66,43.81 36.83,40.64 v39.37,40.64 | v38.1,31.11 38.1,29.21 36.83,27.94 36.83,21.59 35.56,20.32 35.56,19.68 v36.83,18.41
N$1
  Top 0.305: U$6.RST U$6.SLP
N$2  (via drill 0.3)
  Top 0.406: v32.38,10.79 33.66,10.79 RN6.4 | v34.92,7.62 32.38,7.62 30.48,5.71 30.48,3.81 29.21,2.54 PWR.A
  Bottom 0.406: v32.38,10.79 34.92,8.26 v34.92,7.62
N$3
  Top 0.305: 37.78,46.1 35.18,46.1 34.92,45.85 SJ1.2 34.92,44.2 34.04,43.31 34.04,41.78 33.15,40.89 33.15,39.62 32.26,38.73 26.88,38.73 U$6.MS1
  Top 0.406: 37.78,46.1 R5.1
N$4
  Bottom 1.422: U$1.2B 26.67,71.75 18.92,64.01 8.13,64.01 6.86,62.74 6.86,53.59 9.53,53.59 Z-MOT1.1 JP5.1
N$5  (via drill 0.6)
  Top 1.422: U$1.2A 31.75,69.47 32.38,68.83 32.38,64.39 31.62,63.63 21.46,63.63 18.92,61.09 v18.92,56.01 | Z-MOT1.2 JP5.2
  Bottom 1.422: v18.92,56.01 Z-MOT1.2
N$6
  Top 1.422: Z-MOT1.3 JP5.3
  Bottom 1.422: U$1.1A 28.57,75.56 4.45,75.56 1.91,73.03 1.91,61.59 3.81,59.69 JP5.3
N$7
  Top 1.422: Z-MOT1.4 JP5.4
  Bottom 1.422: Z-MOT1.4 19.81,61.09 21.34,62.61 32.89,62.61 34.29,64.01 U$1.1B
N$8
  Bottom 0.305: U$1.SLP U$1.RST
N$9
  Top 0.305: SJ7.2 36.32,70.23 36.83,70.74 38.41,70.74 R1.1 | U$1.MS1 25.15,59.69 27.69,62.23 33.53,62.23 34.54,63.25 34.54,64.9 35.43,65.79 35.43,67.31 36.2,68.07 36.2,69.34
  Top 0.406: 36.2,69.34 SJ7.2
N$10
  Top 0.305: SJ2.2 34.92,41.53 34.04,40.64 34.04,38.35 33.78,38.1 28.78,38.1 U$6.MS2
N$11
  Top 0.305: U$1.MS2 27.43,59.69 29.21,61.47 33.78,61.47 35.18,62.87 35.18,63.88 36.32,65.02 SJ8.2
N$12
  Top 0.305: SJ5.2 34.98,38.28 34.16,37.47 30.68,37.47 U$6.MS3
N$13
  Top 0.406: U$7.RST U$7.SLP
N$14
  Top 0.305: U$1.MS3 30.1,59.69 31.24,60.83 35.56,60.83 36.32,61.59 36.32,63.19 SJ9.2
N$15
  Top 0.406: RN6.2 33.66,13.34 32.38,13.34 30.48,11.43 30.48,9.53 29.84,8.89 27.94,8.89 26.67,7.62 RX_LED.C
N$16  (via drill 0.3)
  Top 0.406: v32.38,12.06 33.66,12.06 RN6.3 | v27.94,3.81 26.67,5.08 TX_LED.C
  Bottom 0.406: v32.38,12.06 35.56,8.89 35.56,8.26 36.83,6.99 36.83,3.17 36.2,2.54 29.21,2.54 v27.94,3.81
N$17
  Top 0.305: 27,20.01 U$7.MS2 28.75,21.97 32.13,21.97 33.78,23.62 33.78,24.13 34.8,25.15 SJ4.2
N$18  (via drill 0.6)
  Top 0.406: Y_STP.A v16,20.57 | v25.27,17.4 31.18,17.4 R4.1
  Bottom 0.406: v16,20.57 16,17.91 16.51,17.4 v25.27,17.4
N$19
  Top 0.406: X_STP.A 15.88,59.69 15.88,61.59 R6.1
N$21  (via drill 0.6)
  Top 1.676: U$6.2B 26.74,46.28 27.81,45.21 28.57,45.21 30.1,43.69 v30.1,40.01
  Bottom 1.676: v30.1,40.01 15.49,40.01 12.45,36.96 9.69,36.96 X-MOT.1
  Bottom 1.778: X-MOT.1 5.46,37 JP2.1
N$22  (via drill 0.6)
  Top 1.676: v32.26,42.04 32.26,45.09 30.86,46.48 30.73,46.48 29.72,47.5 29.72,48.32 U$6.2A
  Bottom 1.676: X-MOT.2 10.84,39.54 13.34,42.04 v32.26,42.04
  Bottom 1.778: X-MOT.2 4.5,39.54 JP2.2
N$23
  Top 0.406: T_STP.A 15.88,48.9 14.61,48.9 R3.1
N$26
  Bottom 1.676: U$6.1A 31.82,47.44 30.86,46.48 13.97,46.48 12.32,48.13 6.86,48.13 6.22,48.77 2.67,48.77 1.4,47.5 1.4,44.83 2.29,43.94 2.72,43.94 JP2.3
  Bottom 1.778: JP2.3 4.59,42.08 X-MOT.3
N$27
  Bottom 1.676: X-MOT.4 12.66,44.62 13.08,44.2 31.88,44.2 34.29,46.61 34.29,48.69 U$6.1B
  Bottom 1.778: X-MOT.4 5.55,44.62 JP2.4
N$28  (via drill 0.6)
  Top 1.676: v29.59,24.26 29.59,27.69 26.8,30.48 U$7.2B
  Top 1.778: U$7.2B
  Bottom 1.676: Y-MOT.1 13.89,20.75 17.14,24 29.34,24 v29.59,24.26
  Bottom 1.778: Y-MOT.1 5.45,20.75 JP7.1
N$29  (via drill 0.6)
  Top 1.676: v31.62,26.29 31.62,28.57 29.34,30.86 U$7.2A
  Bottom 1.676: Y-MOT.2 13,23.29 16,26.29 v31.62,26.29
  Bottom 1.778: Y-MOT.2 4.49,23.29 JP7.2
N$30
  Bottom 1.422: 30.99,30.61 7.49,30.61 5.84,32.26
  Bottom 1.676: U$7.1A 31.87,31.49 30.99,30.61 | 5.84,32.26 2.67,32.26 1.65,31.24 1.65,28.77 4.42,26.01
  Bottom 1.778: Y-MOT.3 4.59,25.83 4.42,26.01 JP7.3
N$31
  Top 0.305: SJ6.2 34.86,22.54 33.53,21.21 30.53,21.21 U$7.MS3
N$33
  Top 0.305: R8.1 37.08,29.97 36.45,30.61 35.31,30.61 34.8,30.1 SJ3.2 34.8,27.94 33.02,26.16 33.02,24.26 31.37,22.61 26.8,22.61 26.59,22.4 26.59,22.35 U$7.MS1
N$36
  Bottom 1.676: Y-MOT.4 32.18,28.37 34.42,30.61 U$7.1B
  Bottom 1.778: Y-MOT.4 5.55,28.37 JP7.4
RESET
  Top 0.406: S2.4 18.41,6.35 24.13,6.35 S2.3
  Bottom 0.406: JP11.1 24.77,6.35 S2.3
  Bottom 1.778: U1.RES JP11.1
SCL
  Top 0.813: U1.D21 JP8.8
SDA
  Top 0.813: U1.D20 JP8.7
SERV1  (via drill 0.3)
  Top 0.406: v8.89,49.53 6.99,51.44 6.35,51.44 5.71,50.8 2.54,50.8 2.54,63.5 v3.81,64.77 | v20.95,52.7 20.95,53.98 23.5,56.52 37.47,56.52 38.73,55.24 JP1.7
  Top 0.813: U1.D9 JP1.7
  Bottom 0.305: JP1.7 39.12,55.24
  Bottom 0.406: v8.89,49.53 12.7,49.53 13.34,48.9 17.14,48.9 v20.95,52.7 | v3.81,64.77 3.81,71.75 4.45,72.39 4.45,73.66 SER1.3
SERV2  (via drill 0.3)
  Top 0.406: v33.02,73.03 33.02,71.75 34.29,70.48 v35.56,70.48 | v46.99,57.78 49.53,55.24 v49.53,52.07 | v55.88,49.53 v49.53,49.53 | v58.42,49.53 58.42,43.81 v68.58,33.66 | v46.35,11.43 45.72,11.43 v42.55,8.26 | v36.83,8.26 35.56,8.26 34.92,8.89 32.38,8.89 v31.75,8.26 | v6.35,50.16 v6.35,17.14 | SER2.3 7.53,73.83 10.54,76.83 v12.06,76.83
  Top 0.813: U1.D10 JP1.6
  Bottom 0.406: 5.71,50.8 2.54,50.8 | 5.71,50.8 6.35,51.44 11.43,51.44 14.61,54.61 21.59,54.61 22.86,53.34 29.72,53.34 30.23,53.85 30.23,55.63 31.11,56.52 34.92,56.52 36.2,55.24 JP1.6 | v12.06,76.83 29.21,76.83 v33.02,73.03 | v35.56,70.48 36.83,69.22 36.83,68.58 36.2,67.94 36.2,67.31 39.37,64.14 42.55,64.14 46.99,59.69 v46.99,57.78 | v49.53,49.53 v49.53,52.07 | v58.42,49.53 v55.88,49.53 | v46.35,11.43 v68.58,33.66 | v36.83,8.26 v42.55,8.26 | v31.75,8.26 22.86,8.26 19.05,12.06 11.43,12.06 v6.35,17.14 | 5.71,50.8 v6.35,50.16
SPI_MISO  (via drill 0.3)
  Top 0.406: v83.19,36.2 83.19,37.47 v90.81,45.09 | v87.63,48.26 87.63,56.52 80.01,64.14 80.01,67.94 78.74,69.22 78.74,73.03 77.47,74.3 61.59,74.3 60.96,73.66 60.96,71.75 59.56,70.36 TFT.30
  Bottom 0.406: v83.19,36.2 83.19,17.78 86.36,14.61 93.98,14.61 U1.D50 | v87.63,48.26 v90.81,45.09
SPI_MOSI
  Top 0.406: 57.15,43.81 57.15,67.31 54.61,69.85 TFT.34 | 57.15,43.81 57.15,33.66 62.23,28.57 RN5.2 | 57.15,43.81 85.72,15.24 94.61,15.24 95.25,14.61 96.52,14.61 U1.D51
SPI_SCK  (via drill 0.3)
  Top 0.406: RN5.1 62.87,29.84 64.14,31.11 68.58,31.11 87.63,12.06 93.98,12.06 U1.D52 | v64.14,62.87 64.14,55.88 64.77,55.24 64.77,48.26 v81.92,31.11
  Bottom 0.406: v64.14,62.87 57.15,69.85 TFT.32 | v81.92,31.11 81.92,17.78 87.63,12.06 93.98,12.06 U1.D52
SPI_SS  (via drill 0.3)
  Top 0.406: U1.D53 96.52,11.43 97.79,10.16 97.79,8.26 97.16,7.62 93.34,7.62 92.71,8.26 80.64,8.26 63.5,25.4 63.5,26.67 62.87,27.3 RN5.3 v60.96,27.3 | v54.61,33.66 v54.61,44.45
  Bottom 0.406: v54.61,44.45 54.61,55.24 52.07,57.78 52.07,69.85 TFT.36 | v60.96,27.3 v54.61,33.66
TFT_CS  (via drill 0.3)
  Top 0.406: v72.39,38.1 72.39,32.38 77.47,27.3 RN4.7 | v69.22,41.27 59.69,50.8 v59.69,53.98
  Bottom 0.406: v69.22,41.27 v72.39,38.1 | v59.69,53.98 59.69,65.41 55.88,69.22 55.88,73.66 56.52,74.3 57.78,74.3 59.05,73.03 TFT.29
TFT_LEDA
  Top 0.305: R26.2 49.44,72.7
  Top 0.406: 49.44,72.7 TFT.37
TFT_RD
  Top 0.305: R13.2 82.38,72.74
  Top 0.406: 82.38,72.74 TFT.11
TFT_REST  (via drill 0.3)
  Top 0.406: v78.74,26.67 78.11,26.04 RN4.8 | v77.47,44.45 77.47,55.24 v72.39,60.33
  Bottom 0.406: v78.74,26.67 78.74,43.18 v77.47,44.45 | v72.39,60.33 63.5,69.22 63.5,73.03 61.59,74.93 55.88,74.93 54.48,73.53 TFT.33
TFT_RS  (via drill 0.6)
  Top 0.406: RN2.2 v86.36,61.59
  Bottom 0.305: 87.76,61.59 88.77,62.61 88.77,71.55 TFT.7
  Bottom 0.406: v86.36,61.59 87.76,61.59
TFT_WR  (via drill 0.6)
  Top 0.305: v84.96,62.87 RN2.1
  Bottom 0.305: 84.98,72.66 83.69,71.37 83.69,64.14 v84.96,62.87
  Bottom 0.406: TFT.9 84.98,72.66
VCC  (via drill 0.3, 0.6)
  Top 0.305: 37.85,40.84 R18.1 36.01,40.7 | v35.94,43.69 SJ2.1 | SJ2.1 35.94,40.77 35.94,39.68 | 42.73,46.03 42.48,45.78 38.99,42.29 SJ2.1 | SJ3.1 v35.81,27.69 SJ4.1 | SJ6.1 35.76,24.51 | 35.76,24.51 35.76,26.23 | R19.1 36.03,24.78 35.76,24.51 | SJ7.1 v37.34,67.82 SJ8.1 37.34,64.64 | 37.34,64.64 37.34,63.3 SJ9.1 37.28,63.05 | R2.1 37.53,64.83 37.34,64.64
  Top 0.406: 45.72,45.95 45.64,46.03 | 45.21,28.96 45.15,28.9 | SJ1.1 v35.94,43.69 | 35.94,39.68 SJ5.1 35.94,39.57 35.94,37.34 35.69,37.08 35.69,34.16 36.95,32.9 U$7.VDD | 36.01,40.7 35.94,40.77 | 43.04,46.03 42.73,46.03 | 35.76,26.23 SJ4.1 | SJ9.1 37.47,62.87 37.47,60.96 38.1,60.33 38.1,59.05 40.64,56.52 41.91,56.52 43.18,55.24 43.18,46.35 42.55,45.72 42.48,45.78 | v6.35,78.74 6.35,71.37 6.48,71.24 | 29.21,7.62 29.21,5.08 TX_LED.A | JP11.3 38.1,8.89 37.47,9.53 35.56,9.53 | 29.21,7.62 29.84,7.62 31.75,9.53 35.56,9.53 | 29.21,7.62 RX_LED.A | RN6.5 35.74,9.71 35.56,9.53 | SER1.2 6.48,71.24 | 6.48,71.24 SER2.2 | SER2.2 | SER2.2 10.04,71.24 JP15.5
  Top 0.61: 45.64,46.03 43.04,46.03
  Top 0.813: 45.21,29.84 45.21,45.82 45.34,45.95 45.72,45.95 | 45.21,22.23 45.34,22.35 | U1.5V@2 U1.5V@1
  Top 1.016: v55.88,43.31 55.88,20.32 48.26,12.7
  Top 1.778: 45.16,29.9 45.21,29.84 45.21,28.96 45.21,22.23 45.21,16.89 48.26,13.84 48.26,12.7 48.26,2.67 47.37,1.78 38.99,1.78 38.1,2.67 U1.5V@0 JP11.3
  Bottom 0.305: v35.94,43.69 35.94,47.8 | v35.81,27.69 35.81,31.57 U$7.VDD | v37.34,67.82 37.34,71.88 U$1.VDD
  Bottom 0.406: 35.94,47.8 U$6.VDD | v6.35,78.74 30.48,78.74 U$1.VDD
  Bottom 0.61: TFT.3 93.85,71.43 93.85,68.96 93.98,68.83 U1.5V@1 88.98,52.15 85.34,48.51 61.09,48.51 v55.88,43.31
VIN  (1 unrouted)
  Bottom 1.016: 17.04,14.71 EXT_PWR.1
  Bottom 2.54: U1.VIN 45.72,7.62 38.63,14.71 17.04,14.71
X-DIR  (via drill 0.3)
  Top 0.406: v97.16,35.56 95.25,35.56 93.98,36.83 U1.D32
  Bottom 0.406: 86.36,37.47 87.63,37.47 CN2.2 | 86.36,37.47 81.92,37.47 80.64,38.73 80.64,42.55 77.47,45.72 72.39,45.72 62.87,36.2 40.01,36.2 U$6.DIR | v97.16,35.56 97.79,34.92 97.79,28.57 97.16,27.94 89.53,27.94 86.36,31.11 86.36,37.47
X-EN  (via drill 0.3)
  Top 0.406: v89.53,41.91 87.63,40.01 CN2.1 | v37.47,37.47 37.47,38.73 R18.2 | v52.07,39.37 v53.34,38.1
  Bottom 0.406: v89.53,41.91 91.44,40.01 93.98,40.01 U1.D30 | U$6.EN 22.23,36.2 23.5,37.47 v37.47,37.47 38.73,38.73 51.44,38.73 v52.07,39.37 | CN2.1 87.63,41.27 82.55,46.35 61.59,46.35 v53.34,38.1
X-MAX  (via drill 0.3)
  Top 0.406: v1.91,34.92 1.91,64.14 3.81,66.04 6.99,66.04 v9.53,68.58 | v74.93,44.45 74.93,50.8 76.2,52.07 U1.D17
  Top 0.813: U1.D17 JP8.4
  Bottom 0.406: v1.91,34.92 3.17,33.66 20.95,33.66 22.23,34.92 70.48,34.92 74.93,39.37 v74.93,44.45 | v9.53,68.58 12.06,71.12 JP15.3
X-MIN  (via drill 0.3)
  Top 0.406: v46.35,77.47 17.14,77.47 13.97,74.3 12.7,74.3 JP15.1
  Top 0.813: U1.D16 JP8.3
  Bottom 0.406: U1.D16 73.66,52.07 74.93,50.8 81.92,50.8 82.55,51.44 82.55,59.05 76.2,65.41 76.2,73.03 70.48,78.74 52.7,78.74 51.44,77.47 v46.35,77.47
X-STEP  (via drill 0.3)
  Top 0.406: U1.D31 96.52,40.01 95.25,40.01 94.61,40.64 90.81,40.64 90.17,40.01 CN1.4 | v11.43,35.56 11.43,44.45 12.06,45.09 12.06,48.26 R3.2 | v40.64,37.47 v40.64,40.01
  Bottom 0.406: 40.64,38.1 52.07,38.1 60.96,46.99 83.19,46.99 90.17,40.01 CN1.4 | 40.64,38.1 39.37,38.1 37.47,36.2 U$6.STEP | v11.43,35.56 19.05,35.56 22.23,38.73 37.47,38.73 38.1,39.37 40.01,39.37 v40.64,40.01 | 40.64,38.1 v40.64,37.47
Y-DIR  (via drill 0.6)
  Top 0.406: v43.81,32.13 v43.81,40.64
  Top 0.813: U1.D8 JP1.8
  Bottom 0.406: v43.81,40.64 43.81,47.12 41.66,49.28 U1.D8 | v43.81,32.13 43.81,24.34 U$7.DIR
Y-EN  (via drill 0.6)
  Top 0.305: v35.81,21.72 36.83,21.72 R19.2 | v48.26,40.64 48.26,32.26
  Top 0.406: 48.26,32.26 49.28,31.24 v49.28,23.88
  Top 0.813: U1.D6 JP3.2
  Bottom 0.305: 22.61,21.72 v35.81,21.72 | U1.D6 v48.26,40.64
  Bottom 0.406: 22.61,21.72 21.71,20.82 U$7.EN 21.71,19.57 22.99,18.29 35.81,18.29 37.21,16.89 42.29,16.89 v49.28,23.88
Y-MAX  (via drill 0.3)
  Top 0.406: v60.33,67.94 59.69,67.94 58.42,69.22 58.42,73.03 57.15,74.3 53.98,74.3 53.34,73.66 53.34,69.85 52.07,68.58 46.35,68.58 39.37,75.56 22.86,75.56 19.05,71.75 15.24,71.75 JP15.4
  Top 0.813: U1.D15 JP8.2
  Bottom 0.406: v60.33,67.94 71.12,57.15 JP8.2
Y-MIN  (via drill 0.3)
  Top 0.406: v46.99,76.2 22.23,76.2 20.32,74.3 15.24,74.3 JP15.2
  Top 0.813: U1.D14 JP8.1
  Bottom 0.406: U1.D14 68.58,52.7 69.22,53.34 79.38,53.34 80.01,53.98 80.01,60.33 73.66,66.67 73.66,73.03 70.48,76.2 v46.99,76.2
Y-STEP  (via drill 0.6)
  Top 0.406: v46.61,44.45 46.61,31.5 47.75,30.35 v47.75,25.53 | R4.2 34.29,17.78 36.83,20.32 U$7.STEP
  Top 0.813: U1.D7 JP3.1
  Bottom 0.406: v46.61,44.45 45.72,45.34 U1.D7 | v47.75,25.53 47.24,25.53 39.88,18.16 38.8,18.16 U$7.STEP
Z-DIR
  Top 0.406: U$1.DIR 46.35,59.69 50.8,55.24 JP3.3
  Top 0.813: U1.D5 JP3.3
Z-EN  (via drill 0.6)
  Top 0.305: R2.2 40.83,62.93 v41.4,62.36 | 55.88,55.24 55.88,55.5
  Top 0.406: U1.D3 JP3.5 55.88,55.24 54.61,55.24 47.62,62.23 41.27,62.23 v41.4,62.36
  Bottom 0.305: v41.4,62.36 41.4,61.85 40.89,61.34 23.24,61.34 U$1.EN
Z-STEP  (via drill 0.3)
  Top 0.406: U1.D4 JP3.4 | v17.78,66.67 13.97,62.87 13.97,62.23 R6.2 | v33.02,70.48 34.92,68.58 v35.56,68.58
  Bottom 0.406: U$1.STEP 40.01,56.52 42.55,56.52 | 42.55,56.52 52.07,56.52 53.34,55.24 JP3.4 | v17.78,66.67 22.86,71.75 22.86,73.03 23.5,73.66 27.3,73.66 27.94,73.03 27.94,71.75 29.21,70.48 v33.02,70.48 | v35.56,68.58 35.56,66.67 38.73,63.5 41.91,63.5 42.55,62.87 42.55,56.52

### Text on the board
tNames: 10K | 10K | 10K | 10K | 10K
_tsilk: S1 | S2 | limits | GND | +V | S | MOTORA | servo | + | X+ | Y+ | X- | Y+ | - | MS1 | MS2 | MS3 | + | A | 1 | MOTORC | + | MS1 | C | MS2 | MS3 | MOTORB | + | MS1 | B | MS2 | MS3 | + | Polarshield v1.5 | + | www.polargraph.co.uk | + | + | GND | 2013.09.01 #339582 | Polarshield v1.5 | + | + | + | + | +
_bsilk: Polarshield v1.5 | www.polargraph.co.uk | + | + | + | GND